# EasyEDA Pro project ProPrj_Anniversary_2026-05-06.epro, schematic Schematic1_1
Board Name: Board1_1; Create Date: 2026-05-01; Page Name: P1; Project Name: Anniversary; Schematic Name: Schematic1_1; Update Date: 2026-04-30; Company: EasyEDA.com; Page Size: A4; Version: V1.0
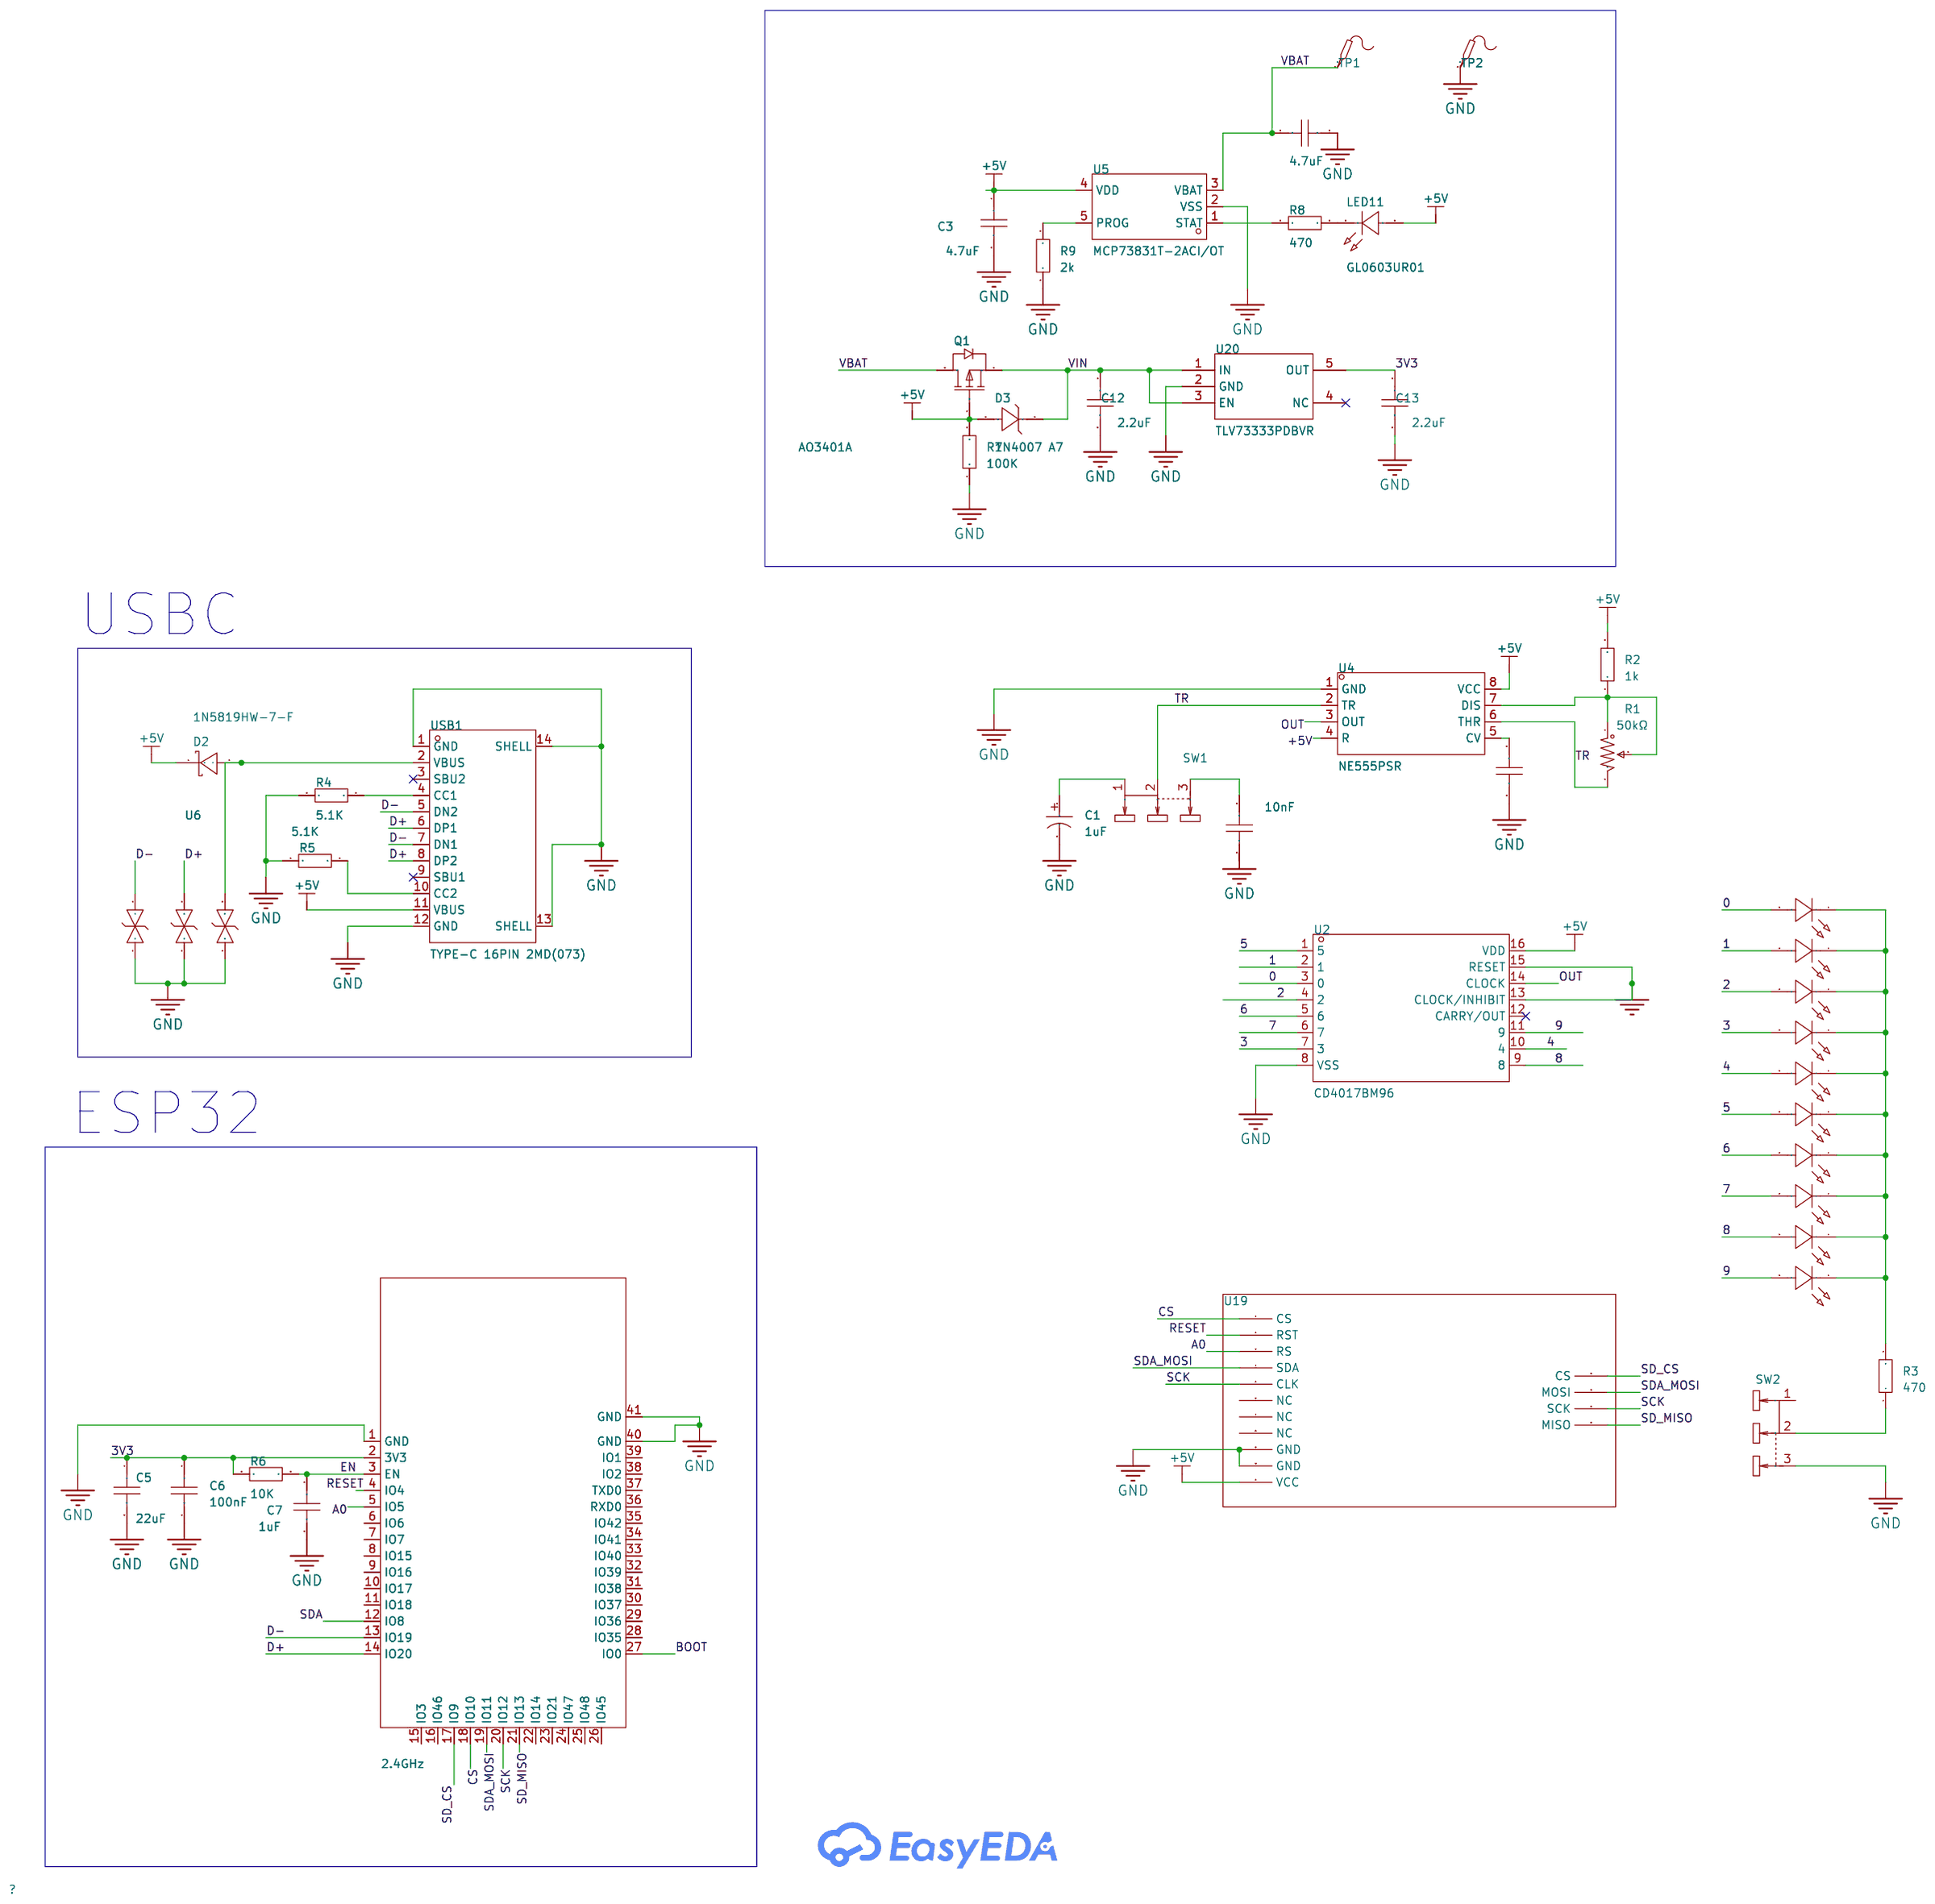
[diagram p2: schematic sheet]

## Parts
C1  1uF  [CAP-SMD_BD4.0-L4.3-W4.3-FD]
C2  10nF  [C0805]
C3  4.7uF  [C0603]
C4  4.7uF  [C0603]
C5  22uF  [C0603]
C6  100nF  [C0603]
C7  1uF  [C0603]
C11  10nF  [C0805]
C12  2.2uF  [C0603]
C13  2.2uF  [C0603]
D2  1N5819HW-7-F  [SOD-123_L2.7-W1.6-LS3.7-RD]
D3  1N4007 A7  [SOD-123FL_L2.7-W1.8-LS3.8-RD]
LED1  XL-2012SURC  [LED0805-RD_RED]
LED2  XL-2012SURC  [LED0805-RD_RED]
LED3  XL-2012SURC  [LED0805-RD_RED]
LED4  XL-2012SURC  [LED0805-RD_RED]
LED5  XL-2012SURC  [LED0805-RD_RED]
LED6  XL-2012SURC  [LED0805-RD_RED]
LED7  XL-2012SURC  [LED0805-RD_RED]
LED8  XL-2012SURC  [LED0805-RD_RED]
LED9  XL-2012SURC  [LED0805-RD_RED]
LED10  XL-2012SURC  [LED0805-RD_RED]
LED11  GL0603UR01  [LED0603-FD]
Q1  AO3401A  [SOT-23_L2.9-W1.3-P1.90-LS2.4-BR]
R1  50kΩ  [RES-ADJ-TH_3P-L9.5-W4.85-P2.50-BL-BS]
R2  1k  [R0603]
R3  470  [R0603]
R4  5.1K  [R0603]
R5  5.1K  [R0603]
R6  10K  [R0603]
R7  100K  [R0603]
R8  470  [R0603]
R9  2k  [R0603]
SW1  SS-12D10L5  [SW-TH_SS-12D10L5]
SW2  SS-12D10L5  [SW-TH_SS-12D10L5]
TP1  -  [Test-Point-0.5mm]
TP2  -  [Test-Point-0.5mm]
U2  CD4017BM96  [SOIC-16_L9.9-W3.9-P1.27-LS6.0-BL]
U4  NE555PSR  [SOIC-8_L6.2-W5.3-P1.27-LS8.0-BL]
U5  MCP73831T-2ACI/OT  [SOT-23-5_L3.0-W1.7-P0.95-LS2.8-BL]
U6  2.4GHz  [WIRELM-SMD_ESP32-S3-WROOM-1]
U16  LESD5D5.0CT1G  [SOD-523_L1.2-W0.8-LS1.6-BI]
U17  LESD5D5.0CT1G  [SOD-523_L1.2-W0.8-LS1.6-BI]
U18  LESD5D5.0CT1G  [SOD-523_L1.2-W0.8-LS1.6-BI]
U19  -  [DST TFT]
U20  TLV73333PDBVR  [SOT-23-5_L3.0-W1.7-P0.95-LS2.8-BR]
USB1  TYPE-C 16PIN 2MD(073)  [USB-C-SMD_TYPE-C-6PIN-2MD-073]

## Library data of the parts
C1 = RVT1H1R0M0405_C72491: Capacitance:1uF Tolerance:±20% Tolerance:±20% Voltage Rating:50V Ripple Current:8mA@120Hz Equivalent Series Resistance(ESR):- Diameter:4mm Height - Seated (Max):5.4mm Lifetime:2000hrs@105℃ Operating Temperature:-40℃~+105℃ Operating Temperature:-40℃~+105℃; LCSC Part Name: 1uF ±20% 50V; Supplier Part: C72491; Manufacturer: ROQANG(容强); Manufacturer Part: RVT1H1R0M0405; Supplier Footprint: SMD,D4xL5.4mm; JLCPCB Part Class: Extended Part; Datasheet: https://item.szlcsc.com/datasheet/RVT1H1R0M0405/73602.html; Supplier: LCSC; Tolerance: ±20%; Voltage Rating: 50V; Ripple Current: 8mA@120Hz; Diameter: 4mm; Height - Seated (Max): 5.4mm; Lifetime: 2000hrs@105℃; Operating Temperature: -40℃~+105℃
C2 C11 = CC0805KRX7R9BB103: Capacitance:10nF Tolerance:±10% Tolerance:±10% Voltage Rating:50V Temperature Coefficient:X7R; LCSC Part Name: 10nF ±10% 50V; Supplier Part: C83170; Manufacturer: YAGEO(国巨); Supplier Footprint: 0805; JLCPCB Part Class: Extended Part; Datasheet: https://item.szlcsc.com/datasheet/CC0805KRX7R9BB103/84334.html; Supplier: LCSC; Tolerance: ±10%; Voltage Rating: 50V; Temperature Coefficient: X7R
C3-C7 C12 C13 = CAP_0603: Supplier Footprint: 0603
D2 = 1N5819HW-7-F: Diode Configuration:1 Independent Voltage - Forward(Vf@If):450mV@1A Voltage - DC Reverse(Vr):40V Current - Rectified:1A Reverse Leakage Current (Ir):1mA@40V Operating Junction Temperature Range:-65℃~+150℃ Operating Junction Temperature Range:-65℃~+150℃ No; LCSC Part Name: 电压:40V 电流:1A; Supplier Part: C82544; Manufacturer: DIODES(美台); Supplier Footprint: SOD-123; JLCPCB Part Class: Extended Part; Datasheet: https://item.szlcsc.com/datasheet/1N5819HW-7-F/83701.html; Supplier: LCSC; Diode Configuration: 1 Independent; Voltage - Forward(Vf@If): 450mV@1A; Voltage - DC Reverse(Vr): 40V; Current - Rectified: 1A; Reverse Leakage Current (Ir): 1mA@40V; Operating Junction Temperature Range: -65℃~+150℃; Non-Repetitive Peak Forward Surge Current: 25A
D3 = 1N4007 A7_C727082: Diode Configuration:Independent Voltage - Forward(Vf@If):1.1V@1A Voltage - DC Reverse(Vr):1kV Current - Rectified:1A Reverse Leakage Current (Ir):5uA Non-Repetitive Peak Forward Surge Current:25A Operating Junction Temperature Range:-55℃~+125℃ Operating J; LCSC Part Name: 1N4007; Supplier Part: C727082; Manufacturer: TWGMC(迪嘉); Supplier Footprint: SOD-123FL; JLCPCB Part Class: Extended Part; Datasheet: https://item.szlcsc.com/datasheet/1N4007%2520A7/774187.html; Supplier: LCSC; Diode Configuration: Independent; Voltage - Forward(Vf@If): 1.1V@1A; Voltage - DC Reverse(Vr): 1kV; Current - Rectified: 1A; Reverse Leakage Current (Ir): 5uA; Non-Repetitive Peak Forward Surge Current: 25A; Operating Junction Temperature Range: -55℃~+125℃
LED1-LED10 = XL-2012SURC: Lamp Holder Type:- Illumination Color:Red Voltage - Forward(Vf):2.3V Voltage - Forward(Vf):2.3V Power(Watts):- Forward Current:20mA Wavelength - Dominant:615nm~630nm Wavelength - Dominant:615nm~630nm Peak Wavelength:620nm Diode Configuration:Discrete Diod; LCSC Part Name: 0805红贴片式发光二极管; Supplier Part: C965812; Manufacturer: XINGLIGHT(成兴光); Supplier Footprint: 0805; JLCPCB Part Class: Extended Part; Datasheet: https://item.szlcsc.com/datasheet/XL-2012SURC/1051421.html; Supplier: LCSC; Illumination Color: Red; Voltage - Forward(Vf): 2.3V; Forward Current: 20mA; Wavelength - Dominant: 615nm~630nm; Peak Wavelength: 620nm; Diode Configuration: Discrete Diode; Lens Color: Water Clear; Luminous Intensity: 230mcd; Viewing Angle: 120°; Mounting Style: Top-mount; Operating Temperature: -40℃~+85℃
LED11 = GL0603UR01: Illumination Color:Red Voltage - Forward(Vf):2.4V Voltage - Forward(Vf):2.4V Forward Current:20mA Wavelength - Dominant:620nm~625nm Wavelength - Dominant:620nm~625nm Diode Configuration:Discrete Diode Lens Color:Water Clear Luminous Intensity:120mcd Lumin; LCSC Part Name: 0603 红灯 高亮; Supplier Part: C51933292; Manufacturer: Guiguang light(桂光光电); Supplier Footprint: 0603; JLCPCB Part Class: Extended Part; Datasheet: https://item.szlcsc.com/datasheet/GL0603UR01/54645988.html; Supplier: LCSC; Illumination Color: Red; Voltage - Forward(Vf): 2.4V; Forward Current: 20mA; Wavelength - Dominant: 620nm~625nm; Diode Configuration: Discrete Diode; Lens Color: Water Clear; Luminous Intensity: 120mcd; Viewing Angle: 120°; Mounting Style: Top-mount; Operating Temperature: -40℃~+85℃
Q1 = AO3401A_C15127: Number:1 P-Channel Drain to Source Voltage:30V Current - Continuous Drain(Id):4A RDS(on):47mΩ@10V；85mΩ@2.5V；60mΩ@4.5V Pd - Power Dissipation:- Gate Threshold Voltage (Vgs(th)):900mV@250uA Gate Charge(Qg):14nC@10V Input Capacitance(Ciss):645pF Reverse Tran; LCSC Part Name: 1个P沟道 耐压:30V 电流:4A; Supplier Part: C15127; Manufacturer: AOS; Supplier Footprint: SOT-23; JLCPCB Part Class: Basic Part; Datasheet: https://item.szlcsc.com/datasheet/AO3401A/15801.html; Supplier: LCSC; Number: 1 P-Channel; Drain to Source Voltage: 30V; Current - Continuous Drain(Id): 4A; RDS(on): 47mΩ@10V；85mΩ@2.5V；60mΩ@4.5V; Gate Threshold Voltage (Vgs(th)): 900mV@250uA; Gate Charge(Qg): 14nC@10V; Input Capacitance(Ciss): 645pF; Reverse Transfer Capacitance (Crss@Vds): 55pF; Output Capacitance(Coss): 80pF
R1 = 3296W-1-503: Resistance:50kΩ Tolerance:±10% Tolerance:±10% Power(Watts):500mW Temperature Coefficient:±250ppm/℃ Temperature Coefficient:±250ppm/℃ Number of Turns:30; LCSC Part Name: 50kΩ ±10%; Supplier Part: C118911; Manufacturer: BOCHEN(博晨); Supplier Footprint: 插件-3P,9.5x4.9mm; JLCPCB Part Class: Extended Part; Datasheet: https://item.szlcsc.com/datasheet/3296W-1-503/120180.html; Supplier: LCSC; Tolerance: ±10%; Power(Watts): 500mW; Temperature Coefficient: ±250ppm/℃; Number of Turns: 30
R2-R9 = Res_0603: Supplier Footprint: 0603
SW1 SW2 = SS-12D10L5: Circuit:SPDT Actuator Style:Rectangular Columnar Termination Style:PC Pin Length:13mm Width:6.8mm Switch Height:6.4mm Mounting Type:Through Hole Actuator Color:Black Current Rating:3A Voltage Rating:125V Life:10,000 Cycles Operating Temperature:-40℃~+85℃; LCSC Part Name: 柄长5mm 直插双档 滑动开关; Supplier Part: C319012; Manufacturer: XKB Connection(中国星坤); Supplier Footprint: 插件,13x6.8mm; JLCPCB Part Class: Extended Part; Datasheet: https://item.szlcsc.com/datasheet/SS-12D10L5/300104.html; Supplier: LCSC; Circuit: SPDT; Actuator Style: Rectangular Columnar; Termination Style: PC Pin; Length: 13mm; Width: 6.8mm; Switch Height: 6.4mm; Mounting Type: Through Hole; Actuator Color: Black; Current Rating: 3A; Voltage Rating: 125V; Life: 10,000 Cycles; Operating Temperature: -40℃~+85℃
TP1 TP2 = Test-Point: Test Point 测试点
U2 = CD4017BM96: Logic Type:Divide-by-10 Direction:Up Counter Voltage - Supply:3V~18V Voltage - Supply:3V~18V Number of Elements:1 Trigger Type:Rising Edge Reset:Asynchronous Timing:- Count Rate:5.5MHz Operating Temperature:-55℃~+125℃ Operating Temperature:-55℃~+125℃ Prop; LCSC Part Name: CMOS 计数器/分频器，高压类型（20V 额定值）; Supplier Part: C11349; Manufacturer: TI(德州仪器); Supplier Footprint: SOIC-16; JLCPCB Part Class: Extended Part; Datasheet: https://www.ti.com/cn/lit/gpn/cd4017b; Supplier: LCSC; Logic Type: Divide-by-10; Direction: Up Counter; Voltage - Supply: 3V~18V; Number of Elements: 1; Trigger Type: Rising Edge; Reset: Asynchronous; Count Rate: 5.5MHz; Operating Temperature: -55℃~+125℃; Propagation Delay: 135ns
U4 = NE555PSR: Timer Number:1 Voltage - Supply:4.5V~16V Voltage - Supply:4.5V~16V Output Current:200mA Supply Current:2mA Operating Temperature:0℃~+70℃ Operating Temperature:0℃~+70℃ Features:占空比可调振荡；复位功能; LCSC Part Name: 555精密定时器; Supplier Part: C105601; Manufacturer: TI(德州仪器); Supplier Footprint: SOIC-8-208mil; JLCPCB Part Class: Extended Part; Datasheet: https://www.ti.com/cn/lit/gpn/se555; Supplier: LCSC; Timer Number: 1; Voltage - Supply: 4.5V~16V; Output Current: 200mA; Supply Current: 2mA; Operating Temperature: 0℃~+70℃; Features: 占空比可调振荡；复位功能
U5 = MCP73831T-2ACI/OT: The Chip Type:Charging IC Voltage - Supply:3.75V~6V Voltage - Supply:3.75V~6V Charge Current - Max:550mA Charging Saturation Voltage:4.2V End-Off Voltage:- Type of Battery:Lithium Battery Number of Cells:1 Number of Cells:1 Operating Temperature:-40℃~+85℃; LCSC Part Name: 单节锂离子/锂聚合物充电管理控制器; Supplier Part: C424093; Manufacturer: MICROCHIP(美国微芯); Supplier Footprint: SOT-23-5; JLCPCB Part Class: Extended Part; Datasheet: https://item.szlcsc.com/datasheet/MCP73831T-2ACI%252FOT/417116.html; Supplier: LCSC; The Chip Type: Charging IC; Voltage - Supply: 3.75V~6V; Charge Current - Max: 550mA; Charging Saturation Voltage: 4.2V; Type of Battery: Lithium Battery; Number of Cells: 1; Operating Temperature: -40℃~+85℃; Battery Temperature Detection: Not supported; Supply Current (Iq): 53uA
U6 = ESP32-S3-WROOM-1-N16R8: Utilized IC / Part:ESP32-S3R8 Interface Type:I2C；GPIO；UART；SPI；USB；I2S Frequency:2.4GHz Antenna Type:On-board PCB Antenna Output Power:20.5dBm Output Power:20.5dBm Voltage - Supply:3V~3.6V Voltage - Supply:3V~3.6V Receive  Current:95mA Send  Current:355mA; LCSC Part Name: 不带固件 通用型Wi-Fi+低功耗蓝牙MCU模组; Supplier Part: C2913202; Manufacturer: ESPRESSIF(乐鑫); Supplier Footprint: SMD,25.5x18mm; JLCPCB Part Class: Extended Part; Datasheet: https://item.szlcsc.com/datasheet/ESP32-S3-WROOM-1-N16R8/3198300.html; Supplier: LCSC; Utilized IC / Part: ESP32-S3R8; Interface Type: I2C；GPIO；UART；SPI；USB；I2S; Antenna Type: On-board PCB Antenna; Output Power: 20.5dBm; Voltage - Supply: 3V~3.6V; Receive  Current: 95mA; Send  Current: 355mA; Sensitivity: -103.5dBm; Operating Temperature: -40℃~+65℃
U16-U18 = LESD5D5.0CT1G_C7433850: Polarity:- Reverse Stand-Off Voltage (Vrwm):5V Clamping Voltage:15V Peak Pulse Current (Ipp):5A Peak Pulse Power Dissipation (Ppp):75W Voltage - Breakdown:9V Reverse Leakage Current (Ir):1uA Number of Channels:1.0 Operating Temperature:-40℃~+150℃ Operatin; Supplier Part: C7433850; Manufacturer: KUU; Supplier Footprint: SOD-523; JLCPCB Part Class: Extended Part; Datasheet: https://item.szlcsc.com/datasheet/LESD5D5.0CT1G/8442902.html; Supplier: LCSC; Reverse Stand-Off Voltage (Vrwm): 5V; Clamping Voltage: 15V; Peak Pulse Current (Ipp): 5A; Peak Pulse Power Dissipation (Ppp): 75W; Voltage - Breakdown: 9V; Reverse Leakage Current (Ir): 1uA; Number of Channels: 1.0; Operating Temperature: -40℃~+150℃; level of protection: IEC 61000-4-2；IEC 61000-4-4; Type: ESD; Junction Capacitance: 15pF
U19 = DSD TECH 1.8 Inch TFT LCD Display
U20 = TLV73333PDBVR: Output Type:Fixed Voltage - Supply:5.5V Output Voltage:3.3V Output Voltage:3.3V Output Current:300mA Power Supply Rejection Ratio (PSRR):50dB@(1kHz) Voltage Dropout:125mV@(300mA) standby current:34uA Noise:28uVrms Features:Under Voltage Lockout；Over Curre; LCSC Part Name: 3.3V 300mA 5.5V; Supplier Part: C134139; Manufacturer: TI(德州仪器); Supplier Footprint: SOT-23-5; JLCPCB Part Class: Extended Part; Datasheet: https://www.ti.com/cn/lit/gpn/tlv733p; Supplier: LCSC; Output Type: Fixed; Voltage - Supply: 5.5V; Output Voltage: 3.3V; Output Current: 300mA; Power Supply Rejection Ratio (PSRR): 50dB@(1kHz); Voltage Dropout: 125mV@(300mA); standby current: 34uA; Noise: 28uVrms; Features: Under Voltage Lockout；Over Current Protection；Enable；Over Temperature Protection; Operating Temperature: -40℃~+125℃@(Tj); Output Configuration: Positive; Number of Outputs: 1
USB1 = TYPE-C 16PIN 2MD(073): Connector Type:Type-C Protocol Standard:- Gender:Female Mounting Type:Surface Mount, Right Angle Number of Contacts:16P Number of Ports:1 Current Rating-Power:3A Voltage Rating:5V Connect-Disconnect Life:5,000 times Supplementary Features:- Center Height:; LCSC Part Name: 16P卧贴母座; Supplier Part: C2765186; Manufacturer: SHOU HAN(首韩); Supplier Footprint: SMD; JLCPCB Part Class: Extended Part; Datasheet: https://item.szlcsc.com/datasheet/TYPE-C%252016PIN%25202MD(073)/2901843.html; Supplier: LCSC; Connector Type: Type-C; Gender: Female; Mounting Type: Surface Mount, Right Angle; Number of Contacts: 16P; Number of Ports: 1; Current Rating-Power: 3A; Voltage Rating: 5V; Connect-Disconnect Life: 5,000 times; Detection color: Black; Operating Temperature: -25℃~+85℃

## Nets
3V3: C5.1 C6.1 C13.1 R6.1 U6.2(3V3) U20.5(OUT)
+5V: C3.1 D2.1(K) D3.2(A) LED11.1(A) Q1.1(G) R2.2 R7.2 U2.16(VDD) U4.4(R) U4.8(VCC) U5.4(VDD) U19.11(VCC) USB1.11(VBUS)
GND: C1.2 C2.1 C3.2 C4.2 C5.2 C6.2 C7.2 C11.1 C12.2 C13.2 R4.1 R5.1 R7.1 R9.1 SW2.3 TP2.1 U2.8(VSS) U2.13(CLOCK/INHIBIT) U2.15(RESET) U4.1(GND) U5.2(VSS) U6.1(GND) U6.40(GND) U6.41(GND) U16.1 U17.1 U18.1 U19.9(GND) U19.10(GND) U20.2(GND) USB1.1(GND) USB1.12(GND) USB1.13(SHELL) USB1.14(SHELL)
VBAT: C4.1 Q1.3(D) TP1.1 U5.3(VBAT)
VIN: C12.1 D3.1(K) Q1.2(S) U20.1(IN) U20.3(EN)
0: LED1.2(A) U2.3(0)
1: LED2.2(A) U2.2(1)
2: LED3.2(A) U2.4(2)
3: LED4.2(A) U2.7(3)
4: LED5.2(A) U2.10(4)
5: LED6.2(A) U2.1(5)
6: LED7.2(A) U2.5(6)
7: LED8.2(A) U2.6(7)
8: LED9.2(A) U2.9(8)
9: LED10.2(A) U2.11(9)
A0: U6.5(IO5) U19.3(RS)
BOOT: U6.27(IO0)
CS: U6.18(IO10) U19.1(CS)
D+: U6.14(IO20) U17.2 USB1.6(DP1) USB1.8(DP2)
D-: U6.13(IO19) U16.2 USB1.5(DN2) USB1.7(DN1)
EN: C7.1 R6.2 U6.3(EN)
OUT: U2.14(CLOCK) U4.3(OUT)
RESET: U6.4(IO4) U19.2(RST)
SCK: U6.20(IO12) U19.5(CLK) U19.14(SCK)
SD_CS: U6.17(IO9) U19.12(CS)
SD_MISO: U6.21(IO13) U19.15(MISO)
SDA: U6.12(IO8)
SDA_MOSI: U6.19(IO11) U19.4(SDA) U19.13(MOSI)
TR: R1.3 SW1.2 U4.2(TR) U4.6(THR)
$1N2239: C2.2 U4.5(CV)
$1N2271: R1.1 R1.2 R2.1 U4.7(DIS)
$1N3321: LED1.1(K) LED2.1(K) LED3.1(K) LED4.1(K) LED5.1(K) LED6.1(K) LED7.1(K) LED8.1(K) LED9.1(K) LED10.1(K) R3.2
$1N11515: C1.1 SW1.1
$1N11545: C11.2 SW1.3
$1N11779: R3.1 SW2.2
$1N12121: D2.2(A) U18.2 USB1.2(VBUS)
$1N12126: R4.2 USB1.4(CC1)
$1N12127: R5.2 USB1.10(CC2)
$1N14369: LED11.2(C) R8.2
$1N14370: R8.1 U5.1(STAT)
$1N14371: R9.2 U5.5(PROG)

Not connected (* = marked no-connect by the designer): SW2 1; U2 12(CARRY/OUT)*; U6 6(IO6) 7(IO7) 8(IO15) 9(IO16) 10(IO17) 11(IO18) 15(IO3) 16(IO46) 22(IO14) 23(IO21) 24(IO47) 25(IO48) 26(IO45) 28(IO35) 29(IO36) 30(IO37) 31(IO38) 32(IO39) 33(IO40) 34(IO41) 35(IO42) 36(RXD0) 37(TXD0) 38(IO2) 39(IO1); U19 6(NC) 7(NC) 8(NC); U20 4(NC)*; USB1 3(SBU2)* 9(SBU1)*

## Notes on the sheet
- USBC
- ESP32
